# Altium project science_board_proj_rev_2.PrjPcb
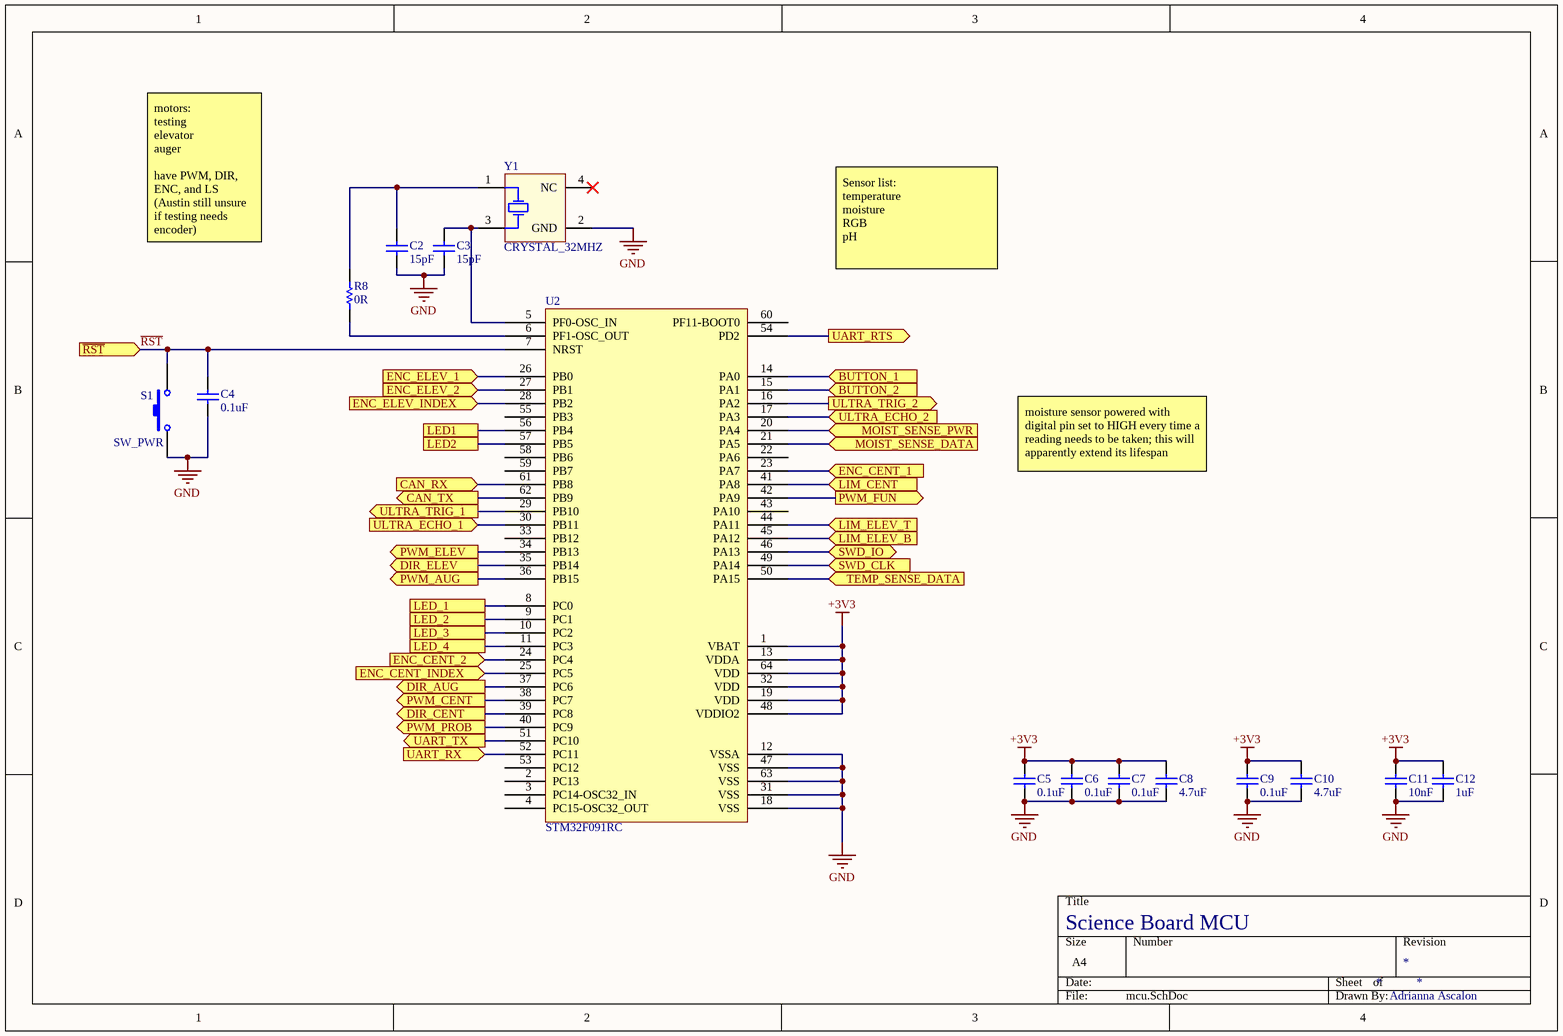
[diagram p0: mcu.SchDoc]
DrawnBy: Adrianna Ascalon
2 sheets, 59 parts. Net scope: flat (ports and power ports of the same name join across sheets).
Board file: science_board_pcb.PcbDoc
Sheets:
  mcu.SchDoc
  support.SchDoc

## Sheet mcu.SchDoc: Science Board MCU
size A4; DrawnBy: Adrianna Ascalon

### Parts
C2  value 15pF  [CAPC0603(1608)55_N]  (hidden comment: CAP_15pF_0603)
C3  value 15pF  [CAPC0603(1608)55_N]  (hidden comment: CAP_15pF_0603)
C4  value 0.1uF  [CAPC0603(1608)55_N]  (hidden comment: CAP_0.1uF_16V_0603)
C5  value 0.1uF  [CAPC0603(1608)55_N]  (hidden comment: CAP_0.1uF_16V_0603)
C6  value 0.1uF  [CAPC0603(1608)55_N]  (hidden comment: CAP_0.1uF_16V_0603)
C7  value 0.1uF  [CAPC0603(1608)55_N]  (hidden comment: CAP_0.1uF_16V_0603)
C8  value 4.7uF  [CAPC0603(1608)55_N]  (hidden comment: CAP_4.7uF_0603)
C9  value 0.1uF  [CAPC0603(1608)55_N]  (hidden comment: CAP_0.1uF_16V_0603)
C10  value 4.7uF  [CAPC0603(1608)55_N]  (hidden comment: CAP_4.7uF_0603)
C11  value 10nF  [CAPC0603(1608)55_N]  (hidden comment: CAP_10nF_0603)
C12  value 1uF  [CAPC0603(1608)55_N]  (hidden comment: CAP_1uF_16V_0603)
R8  value 0R  [RESC0603(1608)_N]  (hidden comment: RES_0R_0603)
S1  SW_PWR  [PTS830GM140]
U2  STM32F091RC  [STM_LQFP64_N]
Y1  CRYSTAL_32MHZ  [AVX-CX2520DB32000D0GEJZ1-4_V]

### Ports
BUTTON_1 (in), BUTTON_2 (in), CAN_RX (in), CAN_TX (out), DIR_AUG (out), DIR_CENT (out), DIR_ELEV (out), ENC_CENT_1 (in), ENC_CENT_2 (in), ENC_CENT_INDEX (in), ENC_ELEV_1 (in), ENC_ELEV_2 (in), ENC_ELEV_INDEX (in), LED1, LED2, LED_1, LED_2, LED_3, LED_4, LIM_CENT (in), LIM_ELEV_B (in), LIM_ELEV_T (in), MOIST_SENSE_DATA (in), MOIST_SENSE_PWR (in), PWM_AUG (out), PWM_CENT (out), PWM_ELEV (out), PWM_FUN (out), PWM_PROB (out), SWD_CLK (in), SWD_IO (bidir), TEMP_SENSE_DATA (in), UART_RTS (out), UART_RX (in), UART_TX (out), ULTRA_ECHO_1 (in), ULTRA_ECHO_2 (in), ULTRA_TRIG_1 (out), ULTRA_TRIG_2 (out), ~{RST} (in)

### Nets
+3V3: C5.1 C6.1 C7.1 C8.2 C9.1 C10.2 C11.2 C12.2 U2.1(VBAT) U2.13(VDDA) U2.19(VDD) U2.32(VDD) U2.48(VDDIO2) U2.64(VDD)
GND: C2.1 C3.1 C4.1 C5.2 C6.2 C7.2 C8.1 C9.2 C10.1 C11.1 C12.1 S1.1 U2.12(VSSA) U2.18(VSS) U2.31(VSS) U2.47(VSS) U2.63(VSS) Y1.2(GND)
~{RST}: C4.2 S1.2 U2.7(NRST) ; port ~{RST}
NetC2_2: C2.2 R8.2 Y1.1(HOT)
NetC3_2: C3.2 U2.5(PF0-OSC_IN) Y1.3(HOT)
NetEC1_1: U2.23(PA7) ; port ENC_CENT_1
NetEC2_1: U2.24(PC4) ; port ENC_CENT_2
NetECI_1: U2.25(PC5) ; port ENC_CENT_INDEX
NetEE1_1: U2.26(PB0) ; port ENC_ELEV_1
NetEE2_1: U2.27(PB1) ; port ENC_ELEV_2
NetEEI_1: U2.28(PB2) ; port ENC_ELEV_INDEX
NetMOIST-D_1: U2.21(PA5) ; port MOIST_SENSE_DATA
NetMOIST-P_1: U2.20(PA4) ; port MOIST_SENSE_PWR
NetPWMA_1: U2.36(PB15) ; port PWM_AUG
NetPWMC_1: U2.38(PC7) ; port PWM_CENT
NetPWME_1: U2.34(PB13) ; port PWM_ELEV
NetPWMF_1: U2.42(PA9) ; port PWM_FUN
NetPWMP_1: U2.40(PC9) ; port PWM_PROB
NetR8_1: R8.1 U2.6(PF1-OSC_OUT)
NetR15_1: U2.41(PA8) ; port LIM_CENT
NetR16_1: U2.44(PA11) ; port LIM_ELEV_T
NetR17_1: U2.45(PA12) ; port LIM_ELEV_B
NetR18_1: U2.8(PC0) ; port LED_1
NetR19_1: U2.9(PC1) ; port LED_2
NetR20_1: U2.14(PA0) ; port BUTTON_1
NetR21_1: U2.10(PC2) ; port LED_3
NetR22_2: U2.15(PA1) ; port BUTTON_2
NetR23_1: U2.11(PC3) ; port LED_4
NetR24_1: U2.57(PB5) ; port LED2
NetR25_1: U2.56(PB4) ; port LED1
NetTEMPT_1: U2.50(PA15) ; port TEMP_SENSE_DATA
NetU2_16: U2.16(PA2) ; port ULTRA_TRIG_2
NetU2_17: U2.17(PA3) ; port ULTRA_ECHO_2
NetU2_29: U2.29(PB10) ; port ULTRA_TRIG_1
NetU2_30: U2.30(PB11) ; port ULTRA_ECHO_1
NetU2_35: U2.35(PB14) ; port DIR_ELEV
NetU2_37: U2.37(PC6) ; port DIR_AUG
NetU2_39: U2.39(PC8) ; port DIR_CENT
NetU2_46: U2.46(PA13) ; port SWD_IO
NetU2_49: U2.49(PA14) ; port SWD_CLK
NetU2_51: U2.51(PC10) ; port UART_TX
NetU2_52: U2.52(PC11) ; port UART_RX
NetU2_54: U2.54(PD2) ; port UART_RTS
NetU2_61: U2.61(PB8) ; port CAN_RX
NetU2_62: U2.62(PB9) ; port CAN_TX

Not connected (* = marked no-connect by the designer): U2 2(PC13) 3(PC14-OSC32_IN) 4(PC15-OSC32_OUT) 22(PA6) 33(PB12) 43(PA10) 53(PC12) 55(PB3) 58(PB6) 59(PB7) 60(PF11-BOOT0); Y1 4(NC)*

### Notes on the sheet
- motors:
  testing
  elevator
  auger
  have PWM, DIR, ENC, and LS
  (Austin still unsure if testing needs encoder)
  Auger doesn't need ENC or LS
- Sensor list:
  temperature
  moisture
  RGB
  pH
- moisture sensor powered with digital pin set to HIGH every time a reading needs to be taken; this will apparently extend its lifespan

### Library data of the parts
C2 C3 = CAP_15pF_0603: CAP CER 15PF 250V NPO 0603; Manufacturer: Yageo; MPN: AC0603JRNPOYBN150; Temperature Coefficient: NP0; Dimensions: 0.063" L x 0.031" W (1.60mm x 0.80mm); Package: 0603 (1608 Metric); Voltage Rating: 250v; Digikey Part Number: 311-3282-1-ND
C4-C7 C9 = CAP_0.1uF_16V_0603: CAP CER 0.1UF 16V X7R 0603; Manufacturer: Yageo; MPN: CC0603KRX7R7BB104; Dimensions: 0.063" L x 0.031" W (1.60mm x 0.80mm); Package: 0603 (1608 Metric); Temperature Coefficient: X7R; Voltage Rating: 16V; Digikey Part Number: 311-1088-1-ND
C8 C10 = CAP_4.7uF_0603: CAP CER 4.7UF 6.3V X5R 0603; Manufacturer: Yageo; MPN: CC0603KRX5R5BB475; Dimensions: 0.063" L x 0.031" W (1.60mm x 0.80mm); Package: 0603 (1608 Metric); Temperature Coefficient: X5R; Voltage Rating: 6.3V; Digikey Part Number: 311-1521-1-ND
C11 = CAP_10nF_0603: CAP CER 10000PF 16V X7R 0603; Manufacturer: Yageo; MPN: CC0603KRX7R7BB103; Dimensions: 0.063" L x 0.031" W (1.60mm x 0.80mm); Package: 0603 (1608 Metric); Temperature Coefficient: X7R; Voltage Rating: 16V; Digikey Part Number: 311-3369-1-ND
C12 = CAP_1uF_16V_0603: CAP CER 1UF 16V Y5V 0603; Manufacturer: Yageo; MPN: CC0603ZRY5V7BB105; Dimensions: 0.063" L x 0.031" W (1.60mm x 0.80mm); Package: 0603 (1608 Metric); Temperature Coefficient: Y5V; Voltage Rating: 16V; Digikey Part Number: 311-1372-1-ND
R8 = RES_0R_0603: RES SMD 0 OHM JUMPER 1/10W 0603; Manufacturer: Yageo; MPN: RC0603JR-070RL; Package: 0603 (1608 Metric); Dimensions: 0.063" L x 0.031" W (1.60mm x 0.80mm); Digikey Part Number: 311-0.0GRCT-ND
S1 = SW_PWR: Power Switch (Red); pin to pad: 2>4; MPN: PTS830GM140 SMTR LFS; Manufacturer: C&K; ComponentLink1Description: Datasheet; ComponentLink1URL: https://www.ckswitches.com/media/1478/pts830.pdf; Digikey Part Number: CKN10587CT-ND
U2 = STM32F091RC: Manufacturer: STMicroelectronics; Package: 64-LQFP; ComponentLink1Description: Datasheet; ComponentLink1URL: https://www.st.com/content/ccc/resource/technical/document/datasheet/95/3c/2e/5b/21/09/45/a6/DM00115237.pdf/files/DM00115237.pdf/jcr:content/translations/en.DM00115237.pdf#%5B%7B%22num%22%3A96%2C%22gen%22%3A0%7D%2C%7B%22name%22%3A%22XYZ%22%7D%2C67%2C755%2Cnull%5D; MPN: STM32F091RC; Digikey Part Number: 497-15167-ND
Y1 = CRYSTAL_32MHZ: CRYSTAL 32MHZ 8PF SMD; Manufacturer: Kyocera International Inc. Electronic Components; MPN: CX2520DB32000D0GPSC1; Package: 4-SMD, No Lead; Dimensions: 0.098" L x 0.079" W (2.50mm x 2.00mm); Digikey Part Number: 1253-1730-1-ND

## Sheet support.SchDoc: Support
size A4; DrawnBy: Adrianna Ascalon
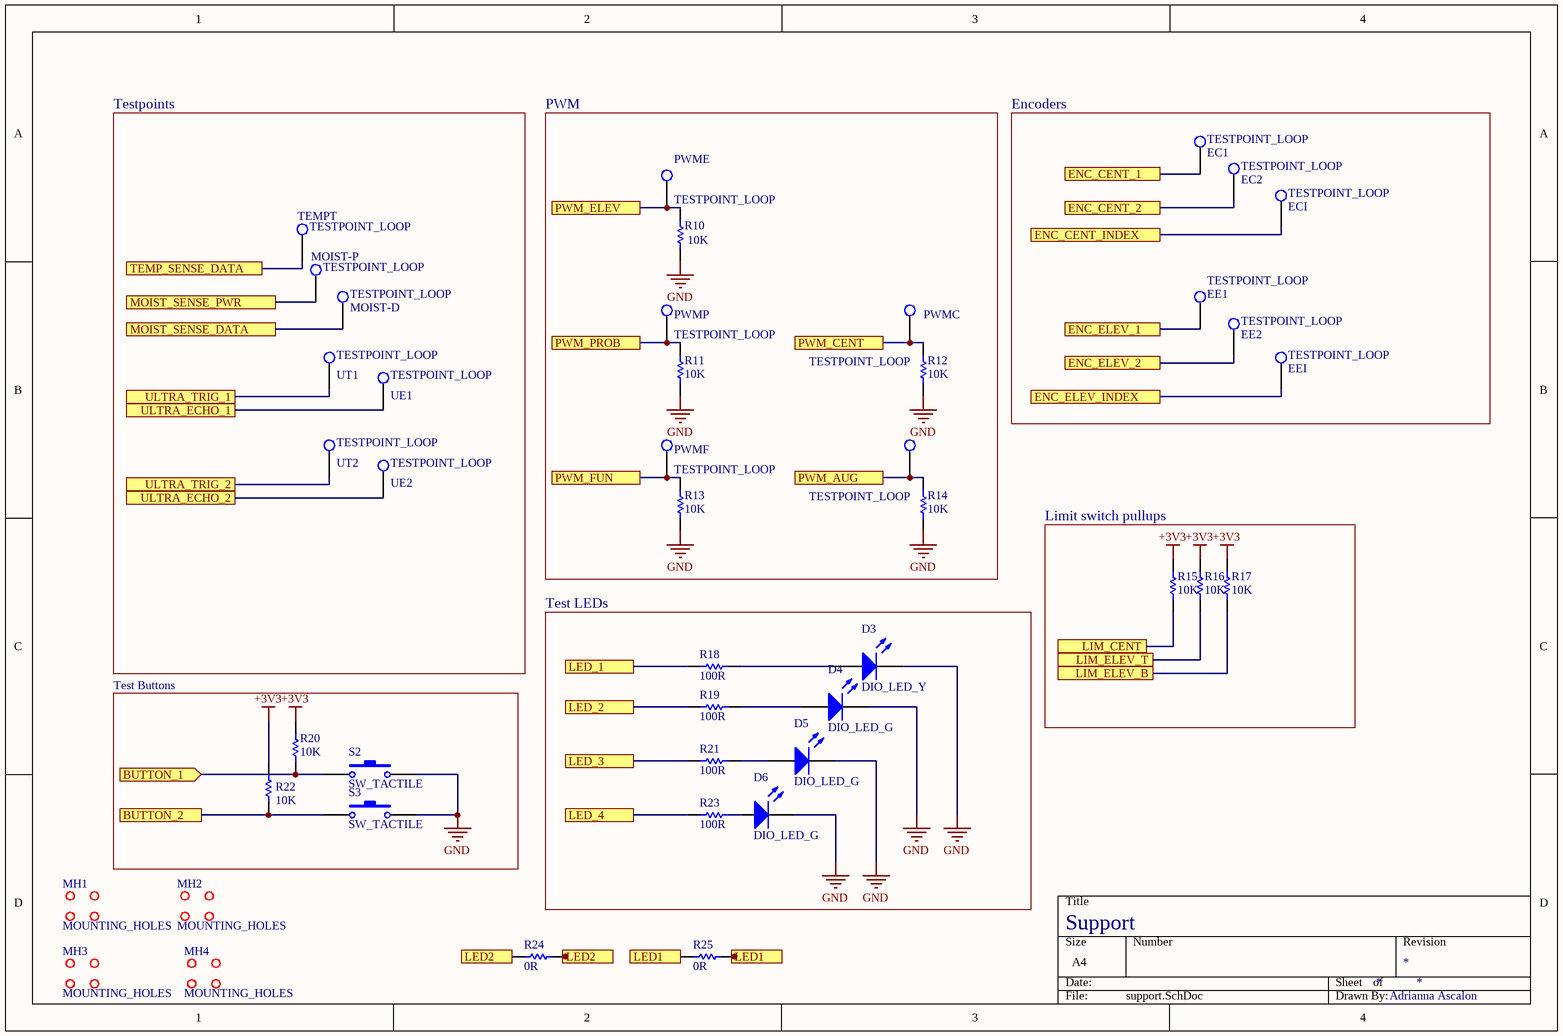
[diagram p1: support.SchDoc]

### Parts
D3  DIO_LED_Y  [LED_0805_LINE]
D4  DIO_LED_G  [LED_0805_LINE]
D5  DIO_LED_G  [LED_0805_LINE]
D6  DIO_LED_G  [LED_0805_LINE]
EC1  TESTPOINT_LOOP  [TESTPOINT_LOOP]
EC2  TESTPOINT_LOOP  [TESTPOINT_LOOP]
ECI  TESTPOINT_LOOP  [TESTPOINT_LOOP]
EE1  TESTPOINT_LOOP  [TESTPOINT_LOOP]
EE2  TESTPOINT_LOOP  [TESTPOINT_LOOP]
EEI  TESTPOINT_LOOP  [TESTPOINT_LOOP]
MH1  MOUNTING_HOLES  [MOUNTING_HOLE]
MH2  MOUNTING_HOLES  [MOUNTING_HOLE]
MH3  MOUNTING_HOLES  [MOUNTING_HOLE]
MH4  MOUNTING_HOLES  [MOUNTING_HOLE]
MOIST-D  TESTPOINT_LOOP  [TESTPOINT_LOOP]
MOIST-P  TESTPOINT_LOOP  [TESTPOINT_LOOP]
PWMA  TESTPOINT_LOOP  [TESTPOINT_LOOP]
PWMC  TESTPOINT_LOOP  [TESTPOINT_LOOP]
PWME  TESTPOINT_LOOP  [TESTPOINT_LOOP]
PWMF  TESTPOINT_LOOP  [TESTPOINT_LOOP]
PWMP  TESTPOINT_LOOP  [TESTPOINT_LOOP]
R10  value 10K  [RESC0603(1608)_N]  (hidden comment: RES_10K_0603)
R11  value 10K  [RESC0603(1608)_N]  (hidden comment: RES_10K_0603)
R12  value 10K  [RESC0603(1608)_N]  (hidden comment: RES_10K_0603)
R13  value 10K  [RESC0603(1608)_N]  (hidden comment: RES_10K_0603)
R14  value 10K  [RESC0603(1608)_N]  (hidden comment: RES_10K_0603)
R15  value 10K  [RESC0603(1608)_N]  (hidden comment: RES_10K_0603)
R16  value 10K  [RESC0603(1608)_N]  (hidden comment: RES_10K_0603)
R17  value 10K  [RESC0603(1608)_N]  (hidden comment: RES_10K_0603)
R18  value 100R  [RESC0603(1608)_N]  (hidden comment: RES_100R_0603)
R19  value 100R  [RESC0603(1608)_N]  (hidden comment: RES_100R_0603)
R20  value 10K  [RESC0603(1608)_N]  (hidden comment: RES_10K_0603)
R21  value 100R  [RESC0603(1608)_N]  (hidden comment: RES_100R_0603)
R22  value 10K  [RESC0603(1608)_N]  (hidden comment: RES_10K_0603)
R23  value 100R  [RESC0603(1608)_N]  (hidden comment: RES_100R_0603)
R24  value 0R  [RESC1206(3216)_N]  (hidden comment: RES_0R_1206)
R25  value 0R  [RESC1206(3216)_N]  (hidden comment: RES_0R_1206)
S2  SW_TACTILE  [B3U-1100P]
S3  SW_TACTILE  [B3U-1100P]
TEMPT  TESTPOINT_LOOP  [TESTPOINT_LOOP]
UE1  TESTPOINT_LOOP  [TESTPOINT_LOOP]
UE2  TESTPOINT_LOOP  [TESTPOINT_LOOP]
UT1  TESTPOINT_LOOP  [TESTPOINT_LOOP]
UT2  TESTPOINT_LOOP  [TESTPOINT_LOOP]

### Blocks framed on the sheet
Testpoints: MOIST-D MOIST-P TEMPT UE1 UE2 UT1 UT2
PWM: PWMA PWMC PWME PWMF PWMP R10-R14
Encoders: EC1 EC2 ECI EE1 EE2 EEI
Limit switch pullups: R15-R17
Test LEDs: D3-D6 R18 R19 R21 R23
Test Buttons: R20 R22 S2 S3

### Ports
BUTTON_1 (in), BUTTON_2, ENC_CENT_1, ENC_CENT_2, ENC_CENT_INDEX, ENC_ELEV_1, ENC_ELEV_2, ENC_ELEV_INDEX, LED1, LED2, LED_1, LED_2, LED_3, LED_4, LIM_CENT, LIM_ELEV_B, LIM_ELEV_T, MOIST_SENSE_DATA, MOIST_SENSE_PWR, PWM_AUG, PWM_CENT, PWM_ELEV, PWM_FUN, PWM_PROB, TEMP_SENSE_DATA, ULTRA_ECHO_1, ULTRA_ECHO_2, ULTRA_TRIG_1, ULTRA_TRIG_2

### Nets
+3V3: R15.2 R16.2 R17.2 R20.2 R22.1
GND: D3.2(K) D4.2(K) D5.2(K) D6.2(K) R10.1 R11.1 R12.1 R13.1 R14.1 S2.2 S3.2
NetD3_1: D3.1(A) R18.2
NetD4_1: D4.1(A) R19.2
NetD5_1: D5.1(A) R21.2
NetD6_1: D6.1(A) R23.2
NetEC1_1: EC1.1(=value) ; port ENC_CENT_1
NetEC2_1: EC2.1(=value) ; port ENC_CENT_2
NetECI_1: ECI.1(=value) ; port ENC_CENT_INDEX
NetEE1_1: EE1.1(=value) ; port ENC_ELEV_1
NetEE2_1: EE2.1(=value) ; port ENC_ELEV_2
NetEEI_1: EEI.1(=value) ; port ENC_ELEV_INDEX
NetMOIST-D_1: MOIST-D.1(=value) ; port MOIST_SENSE_DATA
NetMOIST-P_1: MOIST-P.1(=value) ; port MOIST_SENSE_PWR
NetPWMA_1: PWMA.1(=value) R14.2 ; port PWM_AUG
NetPWMC_1: PWMC.1(=value) R12.2 ; port PWM_CENT
NetPWME_1: PWME.1(=value) R10.2 ; port PWM_ELEV
NetPWMF_1: PWMF.1(=value) R13.2 ; port PWM_FUN
NetPWMP_1: PWMP.1(=value) R11.2 ; port PWM_PROB
NetR15_1: R15.1 ; port LIM_CENT
NetR16_1: R16.1 ; port LIM_ELEV_T
NetR17_1: R17.1 ; port LIM_ELEV_B
NetR18_1: R18.1 ; port LED_1
NetR19_1: R19.1 ; port LED_2
NetR20_1: R20.1 S2.1 ; port BUTTON_1
NetR21_1: R21.1 ; port LED_3
NetR22_2: R22.2 S3.1 ; port BUTTON_2
NetR23_1: R23.1 ; port LED_4
NetR24_1: R24.1 ; port LED2
NetR25_1: R25.1 ; port LED1
NetTEMPT_1: TEMPT.1(=value) ; port TEMP_SENSE_DATA
NetU2_16: UT2.1(=value) ; port ULTRA_TRIG_2
NetU2_17: UE2.1(=value) ; port ULTRA_ECHO_2
NetU2_29: UT1.1(=value) ; port ULTRA_TRIG_1
NetU2_30: UE1.1(=value) ; port ULTRA_ECHO_1

Not connected (* = marked no-connect by the designer): R24 2; R25 2

### Library data of the parts
D3 = DIO_LED_Y: LED YELLOW DIFFUSED 0805 SMD; Manufacturer: OSRAM; MPN: LY R976-PS-36; Forward Voltage Drop: 2.2V; Package: 0805 (2012 Metric); Digikey Part Number: 475-2560-1-ND
D4-D6 = DIO_LED_G: LED GREEN DIFFUSED 0805 SMD; Manufacturer: OSRAM; MPN: LG R971-KN-1; Forward Voltage Drop: 2.2V; Package: 0805 (2012 Metric); Digikey Part Number: 475-1410-1-ND
MH1-MH4 = MOUNTING_HOLES: 6cm x 6cm
R10-R17 R20 R22 = RES_10K_0603: RES SMD 10K OHM 5% 1/10W 0603; Manufacturer: Yageo; MPN: RC0603JR-0710KL; Package: 0603 (1608 Metric); Dimensions: 0.063" L x 0.031" W (1.60mm x 0.80mm); Tolerance: 5%; Digikey Part Number: 311-10KGRCT-ND
R18 R19 R21 R23 = RES_100R_0603: RES SMD 100 OHM 1% 1/10W 0603; Manufacturer: Yageo; MPN: RC0603FR-07100RL; Package: 0603 (1608 Metric); Dimensions: 0.063" L x 0.031" W (1.60mm x 0.80mm); Tolerance: 1%; Digikey Part Number: 311-100HRCT-ND
R24 R25 = RES_0R_1206: RES SMD 0 OHM JUMPER 1/10W 1206; Manufacturer: Yageo; MPN: RC0603JR-070RL; Package: 0603 (1608 Metric); Dimensions: 0.063" L x 0.031" W (1.60mm x 0.80mm); Digikey Part Number: 311-0.0GRCT-ND
S2 S3 = SW_TACTILE: Tactile Switch (Grey); Manufacturer: Omron Electronics Inc-EMC Div; Digikey Part Number: SW1021TR-ND; MPN: B3U-1100P

## Nets that join several sheets
+3V3: mcu (14 pins), support (5 pins)
GND: mcu (18 pins), support (11 pins)
NetEC1_1: mcu (U2.23), support (EC1.1)
NetEC2_1: mcu (U2.24), support (EC2.1)
NetECI_1: mcu (U2.25), support (ECI.1)
NetEE1_1: mcu (U2.26), support (EE1.1)
NetEE2_1: mcu (U2.27), support (EE2.1)
NetEEI_1: mcu (U2.28), support (EEI.1)
NetMOIST-D_1: mcu (U2.21), support (MOIST-D.1)
NetMOIST-P_1: mcu (U2.20), support (MOIST-P.1)
NetPWMA_1: mcu (U2.36), support (PWMA.1 R14.2)
NetPWMC_1: mcu (U2.38), support (PWMC.1 R12.2)
NetPWME_1: mcu (U2.34), support (PWME.1 R10.2)
NetPWMF_1: mcu (U2.42), support (PWMF.1 R13.2)
NetPWMP_1: mcu (U2.40), support (PWMP.1 R11.2)
NetR15_1: mcu (U2.41), support (R15.1)
NetR16_1: mcu (U2.44), support (R16.1)
NetR17_1: mcu (U2.45), support (R17.1)
NetR18_1: mcu (U2.8), support (R18.1)
NetR19_1: mcu (U2.9), support (R19.1)
NetR20_1: mcu (U2.14), support (R20.1 S2.1)
NetR21_1: mcu (U2.10), support (R21.1)
NetR22_2: mcu (U2.15), support (R22.2 S3.1)
NetR23_1: mcu (U2.11), support (R23.1)
NetR24_1: mcu (U2.57), support (R24.1)
NetR25_1: mcu (U2.56), support (R25.1)
NetTEMPT_1: mcu (U2.50), support (TEMPT.1)
NetU2_16: mcu (U2.16), support (UT2.1)
NetU2_17: mcu (U2.17), support (UE2.1)
NetU2_29: mcu (U2.29), support (UT1.1)
NetU2_30: mcu (U2.30), support (UE1.1)